# EasyEDA Pro project easy_eda_proj.eprj, board PCB2
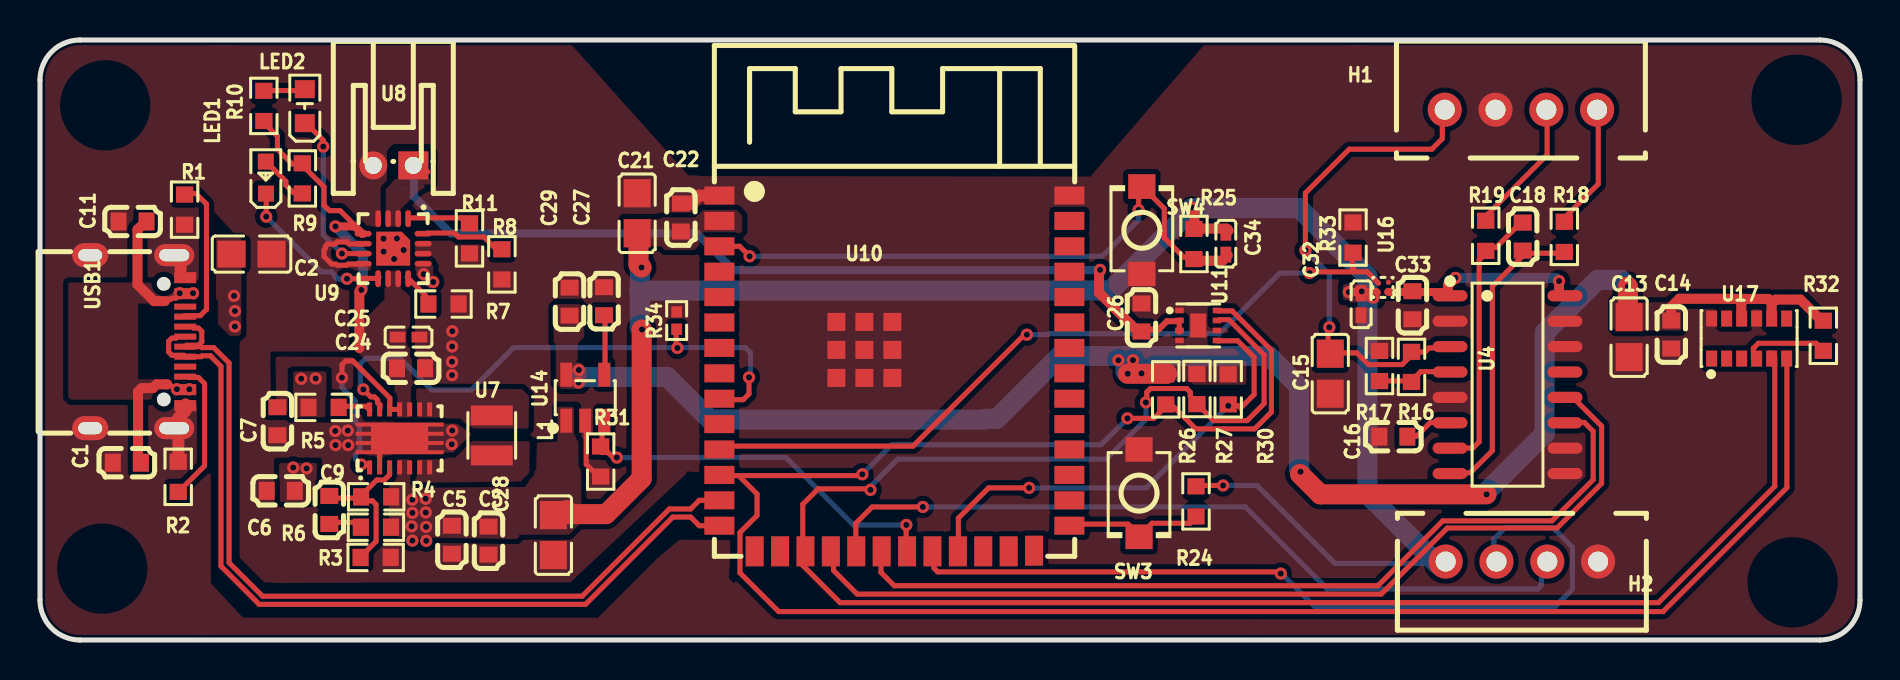
[diagram p3: board, top side]
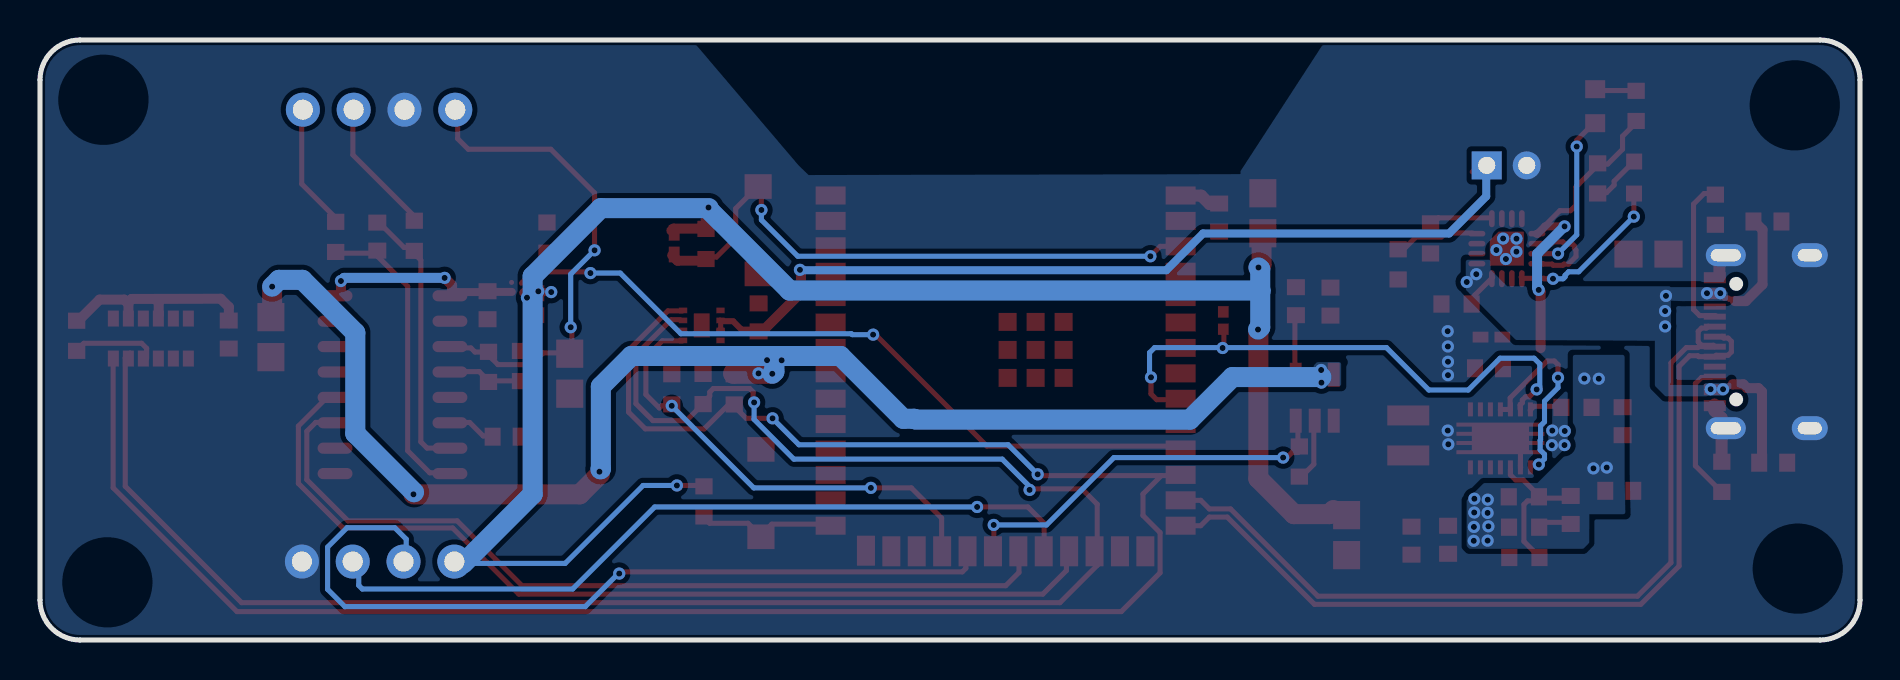
[diagram p4: board, bottom side, seen from below]

Outline 91 x 30 mm; copper layers: Top Layer, Bottom Layer. Coordinates in mm from the lower left corner of the outline.
Outline path: 0,28 0,2 arc(0.59,0.59) 2,0 89,0 arc(90.41,0.59) 91,2 91,28 arc(90.41,29.41) 89,30 2,30 arc(0.59,29.41) 0,28
Stack: Top Layer 0.035mm / Dielectric1 1.51mm FR4 er 4.5 / Bottom Layer 0.035mm

## Design rules (mm)
net D-: DP1
net D+: DP1
template: Custom Config
spacing copperThickness1oz (default): track to track 0.102, other pairs 0.152 to 0.3
spacing copperThickness2oz: track to track 0.203, other pairs 0.152 to 0.3
track width copperThickness1oz (default): min 0.127, default 0.254, max 2.54
track width copperThickness2oz: min 0.203, default 0.254, max 2.54
differential pair differentialPair (default): width min 0.127, default 0.254, max 2.54; gap min 0.152, default 0.152
via viaSize (default): diameter min 0.5, default 0.61, max 10; hole min 0.3, default 0.305, max 6.3
net VBUS uses copperRegion1
net GND uses copperRegion2
net 3.3V uses copperRegion2
net VOUT uses copperRegion1
net $1N2804 uses copperRegion1
net $1N2809 uses copperRegion1
net 3.3V_HX711 uses copperRegion1
net 2.8V uses copperRegion1

## Placement (name value [footprint] x y rotation side)
C1  100nF  [C0603]  4.34 8.86 0 top
C2  10uF  [C0805]  10.58 19.3 180 top
C3  22uF  [C0603]  22.43 4.97 90 top
C5  22uF  [C0603]  20.59 5.01 90 top
C6  22uF  [C0603]  12.04 7.46 0 top
C7  100nF  [C0603]  11.87 10.94 270 top
C9  4.7pF  [C0603]  14.46 6.5 270 top
C11  1uF  [C0603]  4.63 20.93 0 top
C13  4.7uF  [C0805]  79.45 15.14 90 top
C14  100nF  [C0603]  81.56 15.27 90 top
C15  10uF  [C0805]  64.51 13.32 90 top
C16  100nF  [C0603]  67.67 10.17 180 top
C18  100nF  [C0603]  74.14 20.17 270 top
C21  10uF  [C0805]  29.86 21.34 90 top
C22  100nF  [C0603]  32.04 21.12 90 top
C24  22uF  [C0603]  18.55 13.59 180 top
C25  100nF  [C0402]  18.43 15.15 180 top
C26  100nF  [C0603]  55.07 16.13 270 top
C27  10nF  [C0603]  28.2 16.94 90 top
C28  1uF  [C0805]  25.67 5.24 270 top
C29  2.2uF  [C0603]  26.48 16.92 90 top
C32  1uF  [C0402]  66.06 16.79 90 top
C33  10uF  [C0603]  68.62 16.74 90 top
C34  1uF  [C0402]  59.29 19.82 90 top
H1  -  [CONN-TH_B4B-XH-A-LF-SN]  74.05 26.51 0 top
H2  -  [CONN-TH_B4B-XH-A-LF-SN]  74.09 3.92 180 top
L1  1.5uH  [IND-SMD_L2.5-W2.0_MEKK2520TR47M]  22.59 10.23 90 top
LED1  XL-1608SURC-06  [LED0603-RD_RED]  11.3 23.12 90 top
LED2  YLED0603B  [LED0603-FD]  13.24 26.69 270 top
R1  5.1kΩ  [R0603]  7.23 21.52 90 top
R2  5.1kΩ  [R0603]  6.91 8.16 270 top
R3  180kΩ  [R0603]  16.78 4.13 180 top
R4  1MΩ  [R0603]  16.81 7.16 0 top
R5  1MΩ  [R0603]  14.18 11.63 180 top
R6  68kΩ  [R0603]  16.8 5.64 0 top
R7  1.18kΩ  [R0603]  20.17 16.8 180 top
R8  1.13kΩ  [R0603]  23.09 18.78 90 top
R9  1kΩ  [R0603]  13.12 23.08 90 top
R10  1kΩ  [R0603]  11.19 26.7 270 top
R11  10kΩ  [R0603]  21.47 20.08 90 top
R16  20kΩ  [R0603]  68.58 13.66 90 top
R17  8.2kΩ  [R0603]  66.98 13.7 270 top
R18  100Ω  [R0603]  76.22 20.16 90 top
R19  100Ω  [R0603]  72.29 20.21 90 top
R24  10kΩ  [R0603]  57.8 6.93 90 top
R25  10kΩ  [R0603]  57.7 19.8 270 top
R26  10kΩ  [R0603]  56.29 12.53 270 top
R27  10kΩ  [R0603]  57.85 12.55 270 top
R30  10kΩ  [R0603]  59.41 12.53 270 top
R31  10kΩ  [R0603]  28.03 8.92 90 top
R32  47kΩ  [R0603]  89.17 15.21 270 top
R33  10kΩ  [R0603]  65.65 20.12 90 top
R34  100kΩ  [R0402]  31.83 15.97 90 top
SW3  TS-1088-AR02016  [SW-SMD_L3.9-W3.0-P4.45]  54.95 7.35 270 top
SW4  TS-1088-AR02016  [SW-SMD_L3.9-W3.0-P4.45]  55.09 20.49 90 top
U4  HX711  [SOP-16_L10.0-W3.9-P1.27-LS6.0-BL]  73.38 12.77 270 top
U7  TPS63020DSJT  [VSON-14_L4.0-W3.0-P0.50-BL-EP_TI_DSJ]  17.98 10.08 0 top
U8  S2B-PH-K-S(LF)(SN)  [CONN-TH_S2B-PH-K-S-LF-SN]  17.66 23.73 0 top
U9  BQ24075RGTR  [QFN-16_L3.0-W3.0-P0.50-TL-EP1.7]  17.66 19.57 270 top
U10  2.4GHz  [WIRELM-SMD_ESP32-S3-WROOM-1]  42.72 13.33 0 top
U11  MAX17048G+T10  [TDFN-8_L2.0-W2.0-P0.50-BL-EP1.2]  57.91 15.73 270 top
U14  LP2985IM5-2.8  [SOT-23-5_L3.0-W1.6-P0.95-LS2.8-BR]  27.26 12.11 270 top
U16  AP22908CN4-7  [X1-WLB0909-4_L0.9-W0.9-R2-C2-P0.55-BR]  67.15 17.63 0 top
U17  VL6180V1NR/1  [LGA-12_L4.8-W2.8-P0.75-BL]  85.46 15.07 0 top
USB1  TYPE-C 16PIN 2MD(073)  [USB-C-SMD_TYPE-C-6PIN-2MD-073]  4.89 14.92 270 top

## Footprints (pads in the part's own frame, mm; a bottom-side part is the same pattern mirrored in y, then rotated)
C0402
  rect 0.79x0.54 smd: 1(-0.545,0) 2(0.545,0)
C0603
  rect 0.8x0.9 smd: 1(-0.7,0) 2(0.7,0)
C0805
  rect 1.41x1.35 smd: 1(-1,0) 2(1,0)
CONN-TH_B4B-XH-A-LF-SN
  round 1.7 hole 1: 1(-3.81,0) 2(-1.27,0) 3(1.27,0) 4(3.81,0)
CONN-TH_S2B-PH-K-S-LF-SN
  rect 1.5x1.4 hole 0.85: 1(1,0)
  round 1.4 hole 0.85: 2(-1,0)
IND-SMD_L2.5-W2.0_MEKK2520TR47M
  rect 1x2.1 smd: 1(1,0) 2(-1,0)
LED0603-FD
  rect 0.9x1 smd: 1(-0.85,0) 2(0.85,0)
LED0603-RD_RED
  rect 0.8x0.8 smd: 1(-0.799,-0.004) 2(0.799,0.004)
LGA-12_L4.8-W2.8-P0.75-BL
  rect 0.55x0.8 smd: 1(-1.875,-1) 2(-1.125,-1) 3(-0.375,-1) 4(0.375,-1) 5(1.125,-1) 6(1.875,-1) 7(1.875,1) 8(1.125,1) 9(0.375,1) 10(-0.375,1) 11(-1.125,1) 12(-1.875,1)
QFN-16_L3.0-W3.0-P0.50-TL-EP1.7
  oval 0.85x0.28 smd: 1(-1.5,0.75) 2(-1.5,0.25) 3(-1.5,-0.25) 4(-1.5,-0.75) 9(1.5,-0.75) 10(1.5,-0.25) 11(1.5,0.25) 12(1.5,0.75)
  oval 0.28x0.85 smd: 5(-0.75,-1.5) 6(-0.25,-1.5) 7(0.25,-1.5) 8(0.75,-1.5) 13(0.75,1.5) 14(0.25,1.5) 15(-0.25,1.5) 16(-0.75,1.5)
  custom 1.7x1.7 smd: 17(0,0)
R0402
  rect 0.566x0.54 smd: 1(-0.433,0) 2(0.433,0)
R0603
  rect 0.806x0.864 smd: 1(-0.753,0) 2(0.753,0)
SOP-16_L10.0-W3.9-P1.27-LS6.0-BL
  oval 0.56x1.745 smd: 1(-4.445,-2.873) 2(-3.175,-2.873) 3(-1.905,-2.873) 4(-0.635,-2.873) 5(0.635,-2.873) 6(1.905,-2.873) 7(3.175,-2.873) 8(4.445,-2.873) 9(4.445,2.873) 10(3.175,2.873) 11(1.905,2.873) 12(0.635,2.873) 13(-0.635,2.873) 14(-1.905,2.873) 15(-3.175,2.873) 16(-4.445,2.873)
SOT-23-5_L3.0-W1.6-P0.95-LS2.8-BR
  rect 1.2x0.6 smd: 1(1.15,-0.95) 2(1.15,0) 3(1.15,0.95) 4(-1.15,0.95) 5(-1.15,-0.95)
SW-SMD_L3.9-W3.0-P4.45
  rect 1.23x1.36 smd: 1(-2.185,0) 2(2.185,0)
TDFN-8_L2.0-W2.0-P0.50-BL-EP1.2
  rect 0.28x0.425 smd: 1(-0.75,-0.938) 2(-0.25,-0.938) 3(0.25,-0.938) 4(0.75,-0.938) 5(0.75,0.938) 6(0.25,0.938) 7(-0.25,0.938) 8(-0.75,0.938)
  rect 1.2x0.8 smd: 9(0,0)
USB-C-SMD_TYPE-C-6PIN-2MD-073
  rect 0.55x1.1 smd: 1(-3.2,2.375) 2(-2.4,2.375) 11(2.4,2.375) 12(3.2,2.375)
  rect 0.3x1.1 smd: 3(-1.75,2.375) 4(-1.25,2.375) 5(-0.75,2.375) 6(-0.25,2.375) 7(0.25,2.375) 8(0.75,2.375) 9(1.25,2.375) 10(1.75,2.375)
  oval 1.1x2 hole 0.6x1.5: 13(-4.325,1.825) 14(4.325,1.825)
  oval 1.2x1.8 hole 0.6x1.2: 13(-4.325,-2.375) 14(4.325,-2.375)
VSON-14_L4.0-W3.0-P0.50-BL-EP_TI_DSJ
  rect 0.25x0.7 smd: 1(-1.5,-1.45) 2(-1,-1.45) 3(-0.5,-1.45) 4(0,-1.45) 5(0.5,-1.45) 6(1,-1.45) 7(1.5,-1.45) 8(1.5,1.45) 9(1,1.45) 10(0.5,1.45) 11(0,1.45) 12(-0.5,1.45) 13(-1,1.45) 14(-1.5,1.45)
  custom 4.4x1.58 smd: 15(0,0)
WIRELM-SMD_ESP32-S3-WROOM-1
  rect 1.5x0.9 smd: 1(-8.75,8.895) 2(-8.75,7.625) 3(-8.75,6.355) 4(-8.75,5.085) 5(-8.75,3.815) 6(-8.75,2.545) 7(-8.75,1.275) 8(-8.75,0.005) 9(-8.75,-1.265) 10(-8.75,-2.535) 11(-8.75,-3.805) 12(-8.75,-5.075) 13(-8.75,-6.345) 14(-8.75,-7.615) 27(8.75,-7.615) 28(8.75,-6.345) 29(8.75,-5.075) 30(8.75,-3.805) 31(8.75,-2.535) 32(8.75,-1.265) 33(8.75,0.005) 34(8.75,1.275) 35(8.75,2.545) 36(8.75,3.815) 37(8.75,5.085) 38(8.75,6.355) 39(8.75,7.625) 40(8.75,8.895)
  rect 0.9x1.5 smd: 15(-6.985,-8.895) 16(-5.715,-8.895) 17(-4.445,-8.895) 18(-3.175,-8.895) 19(-1.905,-8.895) 20(-0.635,-8.895) 21(0.635,-8.895) 22(1.905,-8.895) 23(3.175,-8.895) 24(4.445,-8.895) 25(5.715,-8.895) 26(6.985,-8.865)
  rect 0.9x0.9 smd: 41(-2.9,2.575) 41(-2.9,1.175) 41(-2.9,-0.225) 41(-1.5,2.575) 41(-1.5,1.175) 41(-1.5,-0.225) 41(-0.1,2.575) 41(-0.1,1.175) 41(-0.1,-0.225)
X1-WLB0909-4_L0.9-W0.9-R2-C2-P0.55-BR
  round 0.25 smd: A1(0.275,-0.25) A2(-0.275,-0.25) B1(0.275,0.25) B2(-0.275,0.25)

## Nets
As in the schematic.

Pads without a net: U4 13; U9 17; U10 4 5 6 7 8 10 15 16 24 25 26 28 29 30 31 32 33 34 35 36 37 38 39; U17 1 2 3 7 11; USB1 3 9

## Via types
v1: diameter 0.61, hole 0.305, Top Layer to Bottom Layer, 82 vias

## Routing (per net, layer and track width the routed paths; a pad name or vN(x,y) marks a point on that pad's centre or on a via; arc(x,y) is an arc through that point)
2.8V: length 82.1
  Top Layer w0.5: 86.55,16.92 86.42,17.05 81.97,17.06 81.56,16.65 81.56,15.84 ; 85.24,17.05 85.07,16.88 85.07,16.26 ; 89.15,15.89 88.02,17.02 86.79,17.02 86.58,16.81 86.58,16.26
  Top Layer w1: 79.35,16.02 79.39,16.06 v1(79.39,17.67) ; 56.35,13.33 56.33,13.31 v1(54.39,13.31) ; v1(72.33,7.28) 64.01,7.28 63,8.3
  Bottom Layer w1: v1(79.39,17.67) 79.05,18.01 77.88,18.01 75.24,15.36 75.24,10.32 72.3,7.39 ; 26.93,13.15 31.38,13.15 33.5,11.02 47.2,11.02 ; 54.28,13.94 54.28,13.42 v1(54.39,13.31) ; 47.27,11.04 47.3,11.06 47.84,11.06 50.98,14.2 61.43,14.2 62.96,12.68 62.96,8.55 62.98,8.53
  vias: v1(26.94,13.5) v1(26.93,12.87) v1(53.92,13.99) v1(54.65,13.99) v1(55.08,13.33) v1(63.03,8.41)
3.3V: length 90.1
  Top Layer w0.254: v1(59.16,7.73) 57.94,7.73 57.91,7.76
  Top Layer w0.4: v1(65.44,17.4) 66.81,17.4 66.84,17.36
  Top Layer w0.5: 57.58,21.49 57.72,21.36 57.72,20.63 ; 57.79,20.57 59.33,20.57 59.43,20.47
  Top Layer w1: v1(30.08,18.63) 29.92,18.78 29.92,20.25 ; 30.08,15.52 30.08,8.07 28.3,6.29 26.53,6.29 26.33,6.5
  Bottom Layer w0.254: v1(59.16,7.73) 60.85,7.73 64.74,3.83 69.83,3.83
  Bottom Layer w1: 29.99,17.46 30.01,17.47 53.52,17.47 57.55,21.51 ; 29.99,17.46 29.99,15.63 v1(30.1,15.52) ; 29.99,17.46 29.99,18.54 v1(30.08,18.63) ; 29.99,17.46 29.97,17.46 ; 57.56,21.59 62.96,21.59 66.37,18.18 66.37,7.29 69.83,3.83 ; 70.25,3.83 69.87,3.83
  vias: v1(12.66,8.62) v1(13.06,13.06) v1(13.33,8.58) v1(13.78,13.07) v1(18.58,5.68) v1(18.61,7.02) v1(18.62,6.36) v1(18.62,4.97) v1(19.28,7.06) v1(19.29,6.38) v1(19.31,5.65) v1(19.31,4.96) v1(57.58,21.62) v1(66.08,17.43) v1(66.65,17.12)
3.3V_HX711: length 10.1
  Top Layer w0.4: 70.4,17.18 70.17,17.4 68.63,17.4 68.63,17.4 67.41,17.4
  Top Layer w0.5: v1(75.95,17.95) 75.95,17.27 75.98,17.24 ; 70.4,17.23 70.4,17.73 v1(70.77,18.11)
  Bottom Layer w0.5: v1(75.95,17.95) 75.8,18.11 v1(70.77,18.11)
GND: length 14.9
  Top Layer w0.254: 16.98,8.72 16.98,8.62 16.97,8.62 16.98,8.72 ; 16.98,8.72 16.98,9.53 17.04,9.6 17.04,9.63 ; 14.28,19.58 14.2,19.5 14.2,19.17 14.58,18.79 14.8,18.79 14.86,18.74 15.34,18.74 15.4,18.79 16.16,18.79 ; 16.18,19.8 15.45,19.8 15.34,19.91 14.86,19.91 14.75,19.8 14.37,19.8 14.26,19.68 ; 27.31,10.86 27.31,8.79 27.97,8.12
  Top Layer w0.6: 7.03,18.15 7.03,18.94 6.72,19.24 ; 33.73,22.21 33.72,22.22 32.94,22.22 32.52,21.8 31.98,21.8 ; 7.28,11.78 7.28,11.46 6.92,11.11 6.92,8.98 6.91,8.97
  vias: v1(14.76,10.45) v1(14.78,9.75) v1(15.39,10.47) v1(15.41,9.74) v1(20.61,14.68) v1(20.6,13.91) v1(20.6,13.24) v1(20.58,9.79) v1(20.62,15.44) v1(20.61,10.47)
VBUS: length 11.6
  Top Layer w0.254: 6.88,12.55 6.72,12.55 6.5,12.77 ; 6.25,17.04 6.54,17.04 6.59,17.1 6.79,17.1 7.03,17.34
  Top Layer w0.5: 6.36,12.78 6.35,12.78 5.83,12.78 5.64,12.59 5.08,12.59 4.9,12.42 4.9,9 5,8.9 ; 6.25,16.95 5.71,16.95 4.87,17.78 4.87,20.52 5.25,20.89 5.33,20.89
  vias: v1(6.85,12.54) v1(6.99,17.34) v1(7.47,12.54) v1(7.65,17.34) v1(9.7,17.21) v1(9.75,16.45) v1(9.75,15.68) v1(19.19,18.29) v1(19.66,17.9)
(no net):
  vias: v1(17.18,20.07) v1(17.18,19.42) v1(17.7,19.05) v1(17.84,20.07) v1(18.18,19.5)
11: length 39.1
  Top Layer w0.254: v1(44.14,6.65) 41.61,6.65 40.79,5.84 40.79,4.38
  Bottom Layer w0.254: v1(44.14,6.65) 60.26,6.65 64.36,2.55 74.88,2.55 75.06,2.73 75.06,3.77 75.24,3.94
14: length 42
  Top Layer w0.254: 44.57,4.49 44.71,4.36 44.71,3.59 44.89,3.41 61.95,3.41 v1(62.04,3.32)
  Bottom Layer w0.254: 62.04,3.37 63.74,1.67 75.75,1.67 76.62,2.54 76.62,4.64 75.65,5.62 73.26,5.62 72.69,5.04 72.69,3.81
32: length 43.3
  Top Layer w0.254: 76.1,10.88 77.21,10.88 77.66,10.44 77.66,8.02 75.6,5.96 70.14,5.96 66.9,2.72 42.71,2.72 42.05,3.38 42.05,4.37 42.1,4.41
34: length 47.1
  Top Layer w0.254: 39.68,4.4 39.68,3.47 40.86,2.29 67.06,2.29 70.37,5.6 75.85,5.6 78.08,7.83 78.08,10.7 76.59,12.18 76.59,12.24
ALERT: length 23
  Top Layer w0.254: v1(59.41,11.71) 59.92,11.71 60.03,11.6 60.71,12.27 60.71,14.14 59.88,14.96 58.87,14.96 ; 45.92,4.53 45.92,6.09 47.43,7.61 v1(49.46,7.61)
  Bottom Layer w0.254: v1(59.41,11.71) 55.31,7.61 v1(49.46,7.61)
CELL: length 44.7
  Top Layer w0.254: 57.01,16 56.97,15.96 ; 56.96,15.97 56.96,15.95 ; 56.96,15.95 56.93,15.92 56.92,15.92 ; 56.96,15.95 56.96,15.48 ; 19.39,23.41 19.14,23.66 18.9,23.66
  Top Layer w0.3: 54.79,15.52 55.93,15.52 56.35,15.94 56.92,15.94 56.95,15.91
  Top Layer w0.4: 56.96,15.48 56.96,15.47
  Top Layer w0.5: 53.02,18.45 52.95,18.38 52.95,17.36 54.79,15.52
  Bottom Layer w0.4: 18.69,23.76 18.69,22.18 20.54,20.33 32.85,20.33 34.68,18.49 53.02,18.49
  vias: v1(53,18.51)
D+: length 41.7
  Top Layer w0.254: U10.14 32.96,5.71 32.53,6.15 31.64,6.15 27.28,1.78 10.96,1.78 9.05,3.7 9.05,13.68 8.52,14.21 8.11,14.21 8.06,14.17 USB1.8 7.19,14.24 6.59,14.24 6.43,14.4 6.43,14.93 6.59,15.1 6.81,15.1 6.9,15.18
D-: length 41.8
  Top Layer w0.254: U10.13 32.96,6.98 32.53,6.55 31.47,6.55 27.11,2.19 11.13,2.19 9.45,3.86 9.45,13.85 8.68,14.62 8.11,14.62 8.06,14.67 USB1.7 7.33,14.74 7.93,14.74 8.09,14.9 8.09,15.43 7.93,15.6 7.68,15.6 7.59,15.69
HX711_ON: length 37.7
  Top Layer w0.254: 66.34,18.41 63.53,18.41 63.49,18.37 ; 65.72,18.48 65.61,18.59 65.61,19.36 ; 33.95,9.69 43.65,9.69 49.22,15.27 v1(49.35,15.27) ; 66.93,17.84 66.34,18.43
  Bottom Layer w0.254: v1(63.48,18.35) 61.99,18.35 58.95,15.31 50.43,15.31 50.38,15.27 v1(49.35,15.27)
PS: length 28.6
  Top Layer w0.254: 31.88,14.58 31.81,14.65 31.81,15.49 ; 34.05,12.03 34.07,12.02 35.16,12.02 35.45,12.3 v1(35.45,13.13) ; 17,11.55 17,11.75 16.88,11.86 16.88,12 16.72,12.16 16.54,12.16 v1(16.17,12.53)
  Bottom Layer w0.254: v1(16.17,12.53) 16.01,12.68 16.01,13.81 16.3,14.09 18,14.09 19.59,12.5 21.56,12.5 23.68,14.62 35.27,14.62 35.52,14.37 35.52,13.21 v1(35.45,13.13)
  vias: v1(31.87,14.6)
SCL: length 94.5
  Top Layer w0.254: v1(41.52,7.51) 41.47,7.56 38.91,7.56 38.14,6.79 38.14,4.67 38.27,4.54 ; 58.97,16.02 59.44,16.02 61.2,14.26 61.2,11.82 60.35,10.97 58.68,10.97 57.94,11.71 ; v1(55.3,11.88) 55.34,11.92 55.34,12.39 55.52,12.57 57.33,12.57 57.51,12.39 57.51,12.2 57.91,11.81 ; 38.12,4.5 38.13,4.49 38.13,3.74 40,1.87 80.92,1.87 86.74,7.69 86.74,14.11 86.51,14.34 86.49,14.34
  Bottom Layer w0.254: v1(55.3,11.88) 55.3,11.03 53.31,9.04 42.89,9.04 41.52,7.68 v1(41.52,7.51)
SDA: length 104.4
  Top Layer w0.254: 87.34,14.15 87.34,7.61 81.15,1.42 36.94,1.42 35,3.36 35,5.37 35.85,6.23 35.85,7.3 34.93,8.22 ; v1(41.12,8.29) 41.05,8.22 34.93,8.22 ; 56.38,11.79 56.55,11.79 57.79,10.56 60.73,10.56 61.57,11.39 61.57,14.49 59.61,16.46 58.9,16.46 ; v1(54.37,11.08) 55.69,11.08 56.27,11.66 ; 34.93,8.22 33.77,8.22 ; 56.25,11.78 56.26,11.77
  Bottom Layer w0.254: v1(41.12,8.29) 42.59,9.76 53.05,9.76 v1(54.37,11.08)
TOF_ON: length 19.8
  Top Layer w0.254: v1(43.32,5.75) 43.31,5.74 43.31,4.56 ; v1(28.84,9.12) 28.66,9.12 28.4,9.38 28.1,9.38 28.1,11 28.28,11.17
  Bottom Layer w0.254: v1(43.32,5.75) 40.67,5.75 37.3,9.12 v1(28.84,9.12)
VOUT: length 26.9
  Top Layer w0.254: 16.46,8.66 16.34,8.78 v1(16.06,8.78) ; 17.49,11.53 17.96,11.53 17.98,11.5 ; 11.17,25.9 11.87,25.19 11.87,24.54 12.61,23.8 13.12,23.8 ; 16.18,20.33 16.17,20.31 15.01,21.47 14.47,21.47 14.2,21.74 14.2,22.65 13.13,23.72 13.13,23.89 ; v1(15.1,13.12) 15.1,13.76 15.28,13.95 15.64,13.95 17.49,12.1 17.49,11.57
  Top Layer w0.4: v1(14.77,20.68) 15.74,20.68 16.11,20.31 16.17,20.31
  Top Layer w0.5: v1(16.06,17.5) 15.97,17.41 15.97,14.59
  Bottom Layer w0.254: v1(16.06,8.78) 15.77,9.06 15.77,9.29 15.99,9.5 15.99,9.99 15.97,10.01 15.97,10.71 15.77,10.91 15.77,11.94 15.1,12.62 v1(15.1,13.12)
  Bottom Layer w0.5: v1(16.06,17.5) 16.06,17.55 16.15,17.63 16.15,19.31 v1(14.77,20.68)
$1N1499: length 7.8
  Top Layer w0.254: 7.21,16.22 8.02,16.22 8.32,16.53 8.32,21.79 7.79,22.32 7.24,22.32
$1N1538: length 7
  Top Layer w0.254: 6.88,7.36 8.23,8.71 8.23,12.82 7.92,13.13 7.42,13.13
$1N2919: length 1.6
  Top Layer w0.254: 14.96,11.69 16.29,11.69 16.49,11.49
$1N3230: length 7.6
  Top Layer w0.254: 16.02,7.09 16.16,6.96 16.62,6.96 16.8,6.78 16.8,4.93 15.98,4.11 ; 14.51,7.09 15.94,7.09 ; 16.02,7.18 16.84,8 17.22,8 17.48,8.26 17.48,8.52 ; 15.98,7.13 16.02,7.17
$1N3482: length 1.7
  Top Layer w0.254: 14.4,5.88 15.79,5.88 16.02,5.65
$1N4163: length 1.8
  Top Layer w0.254: 18.36,18.14 19.27,17.23 19.27,16.75
$1N4202: length 4.1
  Top Layer w0.254: 23.08,19.5 22.84,19.5 22.2,20.15 20.93,20.15 20.73,20.35 19.38,20.35
$1N4584: length 8.2
  Top Layer w0.254: v1(15.35,18.06) 15.8,18.06 15.82,18.09 16.31,18.09 16.32,18.08 16.89,18.08 16.95,18.14 ; 11.31,22.32 v1(11.31,21.17)
  Bottom Layer w0.254: v1(15.35,18.06) 14.84,18.06 14.75,18.16 14.75,18.23 14.57,18.41 14.07,18.41 v1(11.31,21.17)
$1N4586: length 2.5
  Top Layer w0.254: 13.15,22.37 12.67,22.37 12.29,22.75 12.29,22.93 11.37,23.86
$1N4675: length 8.3
  Top Layer w0.254: v1(14.16,24.67) 14.16,24.99 13.28,25.87 ; v1(15.1,19.32) 15.19,19.32 15.19,19.32 16,19.32 16.04,19.28
  Bottom Layer w0.254: v1(14.16,24.67) 14.16,20.26 v1(15.1,19.32)
$1N4721: length 2.1
  Top Layer w0.254: 13.26,27.56 13.17,27.47 11.17,27.47
$1N4792: length 3.1
  Top Layer w0.254: 21.4,20.78 21.07,21.11 18.42,21.11
$1N5724: length 3.6
  Top Layer w0.254: 70.46,13.42 69.04,13.42 68.49,12.87 ; 66.94,12.96 68.39,12.96
$1N5746: length 23.8
  Top Layer w0.254: v1(63.27,19.49) 63.27,22.35 65.46,24.54 69.59,24.54 70.12,25.07 70.12,26.52 ; 70.53,14.58 70.5,14.6 69.46,14.6 69.25,14.4 68.65,14.4 ; 68.57,14.24 68.11,13.77 66.43,13.77 65.84,14.36 64.63,14.36 ; v1(64.47,15.64) 64.41,15.58 64.41,14.81
  Bottom Layer w0.254: v1(63.27,19.49) 64.47,18.29 v1(64.47,15.64)
$1N5829: length 2.5
  Top Layer w0.254: 70.55,10.88 69.52,10.88 68.84,10.2 68.36,10.2
$1N6086: length 15.5
  Top Layer w0.254: 70.41,8.36 71.51,8.36 72.62,9.46 72.62,17.68 74.12,19.18 74.12,19.54 ; 76.06,19.54 75.86,19.34 74.39,19.34 74.14,19.58
$1N6088: length 13.8
  Top Layer w0.254: 72.31,19.34 71.96,18.99 71.96,9.91 71.65,9.6 70.43,9.6 70.37,9.53 ; 74.19,21.02 72.8,19.63 72.25,19.63
$1N6257: length 5.9
  Top Layer w0.254: 77.91,26.4 77.91,22.8 76.26,21.15
$1N6263: length 6.7
  Top Layer w0.254: 72.29,21.19 75.36,24.26 75.36,26.57
$1N25078: length 6.7
  Top Layer w0.254: 57.73,6.06 57.51,5.84 55.6,5.84 55.07,5.31 54.98,5.31 ; 54.89,5.31 54.41,5.79 51.42,5.79
$1N25329: length 30
  Top Layer w0.254: 55.11,22.67 56.21,21.57 56.21,20.11 57.18,19.15 57.54,19.15 57.67,19.02 ; 34.13,19.68 34.98,19.68 v1(35.48,19.19) ; v1(54.93,21.5) 54.93,22.46 55.06,22.59
  Top Layer w0.5: 57.86,18.96 59.12,18.96 59.39,19.23
  Bottom Layer w0.254: v1(35.48,19.19) 53.11,19.19 54.93,21.01 v1(54.93,21.5)
$1N40837: length 3
  Top Layer w0.254: 28.26,13.29 28.25,13.3 28.25,16.24
$1N41276: length 4.2
  Top Layer w0.254: 89.14,14.51 88.81,14.84 85.92,14.84 85.67,14.58 85.67,14.08

## Copper pours and planes (outline as drawn; the poured copper is in the pictures)
2.8V on Top Layer: 78.66,16.94 78.66,15.59 78.77,15.47 82.05,15.47 82.08,15.5 82.08,16.84 82.12,16.88 79.49,16.88 79.35,17.03 78.74,17.03
2.8V on Top Layer: 25.84,13.87 25.84,12.86 26.13,12.56 27.08,12.56 27.32,12.8 27.32,13.57 27.02,13.87
2.8V on Top Layer: 60.35,12.8 60.35,13.96 55.64,13.96 55.61,13.93 55.61,13.06 55.74,12.93 55.61,12.8 55.61,12.76 60.31,12.76
2.8V on Top Layer: 25.68,14.91 25.79,14.8 25.79,12.84 26.07,12.55 26.78,12.55 26.82,12.6 26.82,13.96 26.89,14.03 26.89,14.82 27.22,15.15 27.22,16.51 27.24,16.54 26.97,16.8 25.83,16.8 25.68,16.65
2.8V on Bottom Layer: 25.87,13.89 25.94,13.81 25.94,12.69 27.17,12.69 27.31,12.84 27.31,13.73 27.15,13.89
3.3V on Top Layer: 17.78,9.04 17.78,8.19 17.45,7.87 17.45,5.35 17.77,5.35 18.42,4.7 19.5,4.7 19.82,5.01 23.81,5.01 23.96,5.17 23.96,7.53 23.59,7.91 18.94,7.91 18.77,8.08 18.77,8.9 18.55,9.11 17.85,9.11
3.3V on Top Layer: 11.95,8.93 11.95,7.01 12.06,6.9 13.54,6.9 13.78,7.14 13.78,7.99 13.85,8.06 13.85,8.94 11.96,8.94
3.3V on Top Layer: 65.15,17.75 65.15,17 65.4,17 65.55,16.84 66.9,16.84 66.93,16.82 66.99,16.88 66.99,17.49 66.68,17.8 65.19,17.8
3.3V on Top Layer: 31.04,21.13 31.04,19.71 31.24,19.5 32.73,19.5 33.01,19.78 33.01,20.25 33.07,20.31 34.97,20.31 35.12,20.45 35.12,21.22 34.83,21.51 33.15,21.51 32.77,21.13
3.3V on Top Layer: 23.67,7.64 23.67,5.27 26.46,5.27 27.06,5.87 27.06,9.8 26.81,10.05 26.81,10.64 26.8,10.65 26.8,11.66 25.87,11.66 25.88,9.92 24.85,9.87 24.81,8.56 24.26,7.65
3.3V on Top Layer: 29.21,21.07 29.21,19.7 29.23,19.68 32.69,19.68 32.8,19.79 32.8,20.98 32.88,21.06 29.22,21.06
3.3V on Top Layer: 12.66,13.43 12.65,10.91 12.69,10.87 14.29,10.87 14.33,10.91 14.33,13.43
3.3V on Bottom Layer: 11.77,14.26 11.77,8.28 11.73,6.29 13.53,6.29 13.54,4.86 13.83,4.56 19.53,4.56 19.67,4.7 19.67,6.99 18.8,7.85 16.13,7.85 14.35,9.62 14.35,14.26
GND on Top Layer: 34.54,-0.39 61.25,-0.39 61.4,-0.24 61.01,0.16 61.01,1.11 36.66,1.11 34.85,2.92 34.85,3 34.54,2.7
GND on Top Layer: 18.74,12.72 24.13,12.72 24.5,13.09 24.49,18.44 22.95,18.64 22.19,19.39 22.19,19.85 19.78,19.85 19.69,19.94 18.71,19.94 18.62,19.85 18.62,19.23 18.8,19.05 19.67,19.05 20.07,18.65 20.07,16.29 19.68,15.9 18.93,15.9 18.48,15.45 18.48,14.83 18.84,14.47 18.84,12.82
GND on Top Layer: 60.66,22.2 60.63,22.59 65.74,30.11 65.88,30 98.42,29.79 98.2,29.55 98.43,-0.59 97.61,-1.47 61.24,-1.09 60.69,-0.73
GND on Top Layer: 32.62,23.05 31.28,23.06 32.57,23.06 26.18,30.2 25.24,30.64 25.06,30.56 8.48,30.59 8.3,21.85 9.98,20.03 9.98,4.11 11.21,2.88 26.52,2.88 32.32,8.32
GND on Top Layer: 13.38,20.31 13.38,18.65 13.56,18.47 14.62,18.47 14.8,18.65 14.8,19.94 14.82,19.97 14.82,20.12 14.62,20.31
GND on Top Layer: 6.67,12.05 6.67,11.38 6.62,11.33 5.87,11.33 5.66,11.12 5.66,10.05 5.77,9.94 7.7,9.94 7.94,10.18 7.94,12.06 7.93,12.05
GND on Top Layer: 27.25,29.12 27.48,11.73 32.16,8.44 34.67,8.22 34.9,8.2 34.95,7.06 34.97,5.12 32.72,5.1 32.69,2.42 34.79,0.33 67.03,-0.17 68.57,4.4 68.57,27.62 65.77,30.06 58.58,30.19 52.52,23.17 33.05,23.2 33.05,23.21 30.83,23.31
GND on Top Layer: 10.33,20.17 10.32,14.24 10.37,10.38 10.49,10.27 11.11,10.31 11.57,10.27 11.52,13.99 11.54,14.59 14.66,14.61 14.62,18.38 13.63,20.19 13.61,20.21 10.37,20.21
GND on Top Layer: -0.83,30.93 -0.83,0.07 -0.14,-0.62 8.64,-0.6 8.54,-0.07 8.54,21.49 9.78,22.73 9.78,31.39 -0.37,31.39
GND on Top Layer: 16.78,10.88 16.72,9.18 16.66,9.12 10.69,9.12 10.49,9.31 10.49,10.82 10.54,10.87 16.47,10.87 16.68,10.83 16.71,10.88
GND on Top Layer: 10.38,11.09 10.38,4.13 11.66,2.84 24.54,2.93 24.57,3.69 24.47,4.78 12.24,4.97 11.93,5.28 11.93,9.1 12.35,9.53 12.35,11.04 12.31,11.09
GND on Top Layer: 7.73,3.38 7.73,-0.19 8.43,-0.9 34.5,-0.9 35.09,-0.3 35.09,2.43 34.45,3.07 34.45,3.47 34.48,3.54 34.52,5 31.97,5.01 30.87,4.09 27.89,1.11 10.15,1.11 8.17,3.24 8,3.28
GND on Top Layer: 19.18,11.03 19.17,9.31 19.25,9.24 20.61,9.24 21.19,9.76 21.2,10.49 20.53,11.02
GND on Bottom Layer: 30.96,23.47 26,31.1 3.67,31.13 3.28,31.52 -0.31,31.52 -2.64,29.19 -2.64,-0.99 -1.14,-2.48 90.98,-2.48 93.91,0.45 93.91,28.77 92.41,30.27 58.63,30.27 53.1,23.76 52.57,23.25 31.01,23.29 30.96,23.34 31,23.38 31.01,23.38
VBUS on Top Layer: 1.45,17.88 4.87,17.88 5.83,17.87 6.73,17.73 7.81,17.71 7.79,16.82 4.91,16.82 4.91,13.03 7.83,13.04 7.81,12.59 7.83,12.34 7.7,12.01 1.54,12.01 1.41,12.14 1.41,17.84
VBUS on Top Layer: 18.69,18.17 19.26,17.6 19.55,17.6 19.67,17.72 19.67,18.97 19.67,18.98 18.73,18.98 18.7,19.01 18.69,19.01
VBUS on Top Layer: 8.75,20.1 8.75,17.12 8.89,16.98 8.89,15.8 9.48,15.2 9.95,15.2 10.18,15.43 10.18,19.98 10.05,20.1
VBUS on Bottom Layer: 9.45,17.67 9.45,12.85 9.8,12.51 10.15,12.62 10.17,14.96 17.2,15 19.71,17.51 19.71,19.01 18.49,19.01 18.47,19.03 18.47,18.52 17.64,17.69 8.03,17.69 8.04,17.67
VBUS on Bottom Layer: 7.57,12.84 7.57,12.22 7.61,12.18 9.74,12.18 10.26,12.7 10.26,17.26 9.87,17.65 6.67,17.65 6.6,17.58 6.6,17 6.65,16.95 8.91,16.95 9.58,16.97 9.55,14.04 9.5,12.76 7.83,12.74 7.74,12.83 7.58,12.83
VBUS on Bottom Layer: 7.79,12.25 7.79,12.81 7.82,12.84 6.6,12.84 6.43,13.01 6.43,12.41 6.62,12.21 7.75,12.21
CELL on Top Layer: 17.29,20.68 17.3,20.66 17.99,20.66 18.04,20.71 18.04,21.55 18.96,22.46 19.61,22.81 19.61,24.4 19.47,24.55 17.78,24.55 17.61,24.38 17.61,22.87 17.29,22.55
VOUT on Top Layer: 17.22,18.62 17.22,17.04 17.23,17.03 15.75,15.55 15.71,14.59 17.37,12.79 17.73,12.77 17.72,11.27 18.01,10.98 18.62,10.98 18.67,11.03 18.67,12.3 18.73,12.36 18.73,13.92 18.51,14.14 18.51,17.19 18.14,17.56 18.14,18.64
VOUT on Top Layer: 11.42,11.35 11.51,11.26 12.39,11.26 12.39,13.58 14.58,13.56 14.6,12.52 15.66,12.54 15.67,14.15 11.49,14.17 11.42,14.1
$1N2804 on Top Layer: 24.43,10.57 21.67,10.57 21.13,10.93 21.13,10.95 21.02,11.07 18.91,11.07 18.8,11.18 18.8,12.02 18.81,12.58 24.1,12.55 24.46,12.19
$1N2809 on Top Layer: 18.78,9.11 18.77,7.86 24.04,7.92 24.46,8.37 24.48,9.94 21.6,9.96 20.77,9.12 18.79,9.12

Small or netless copper shapes (teardrops, artwork), in the pictures only: 3 on Top Layer, 1 on Bottom Layer
